# EAGLE design OSO-MISC-20-022 New Blinky Board for Ring (EAGLE 9.6.2)
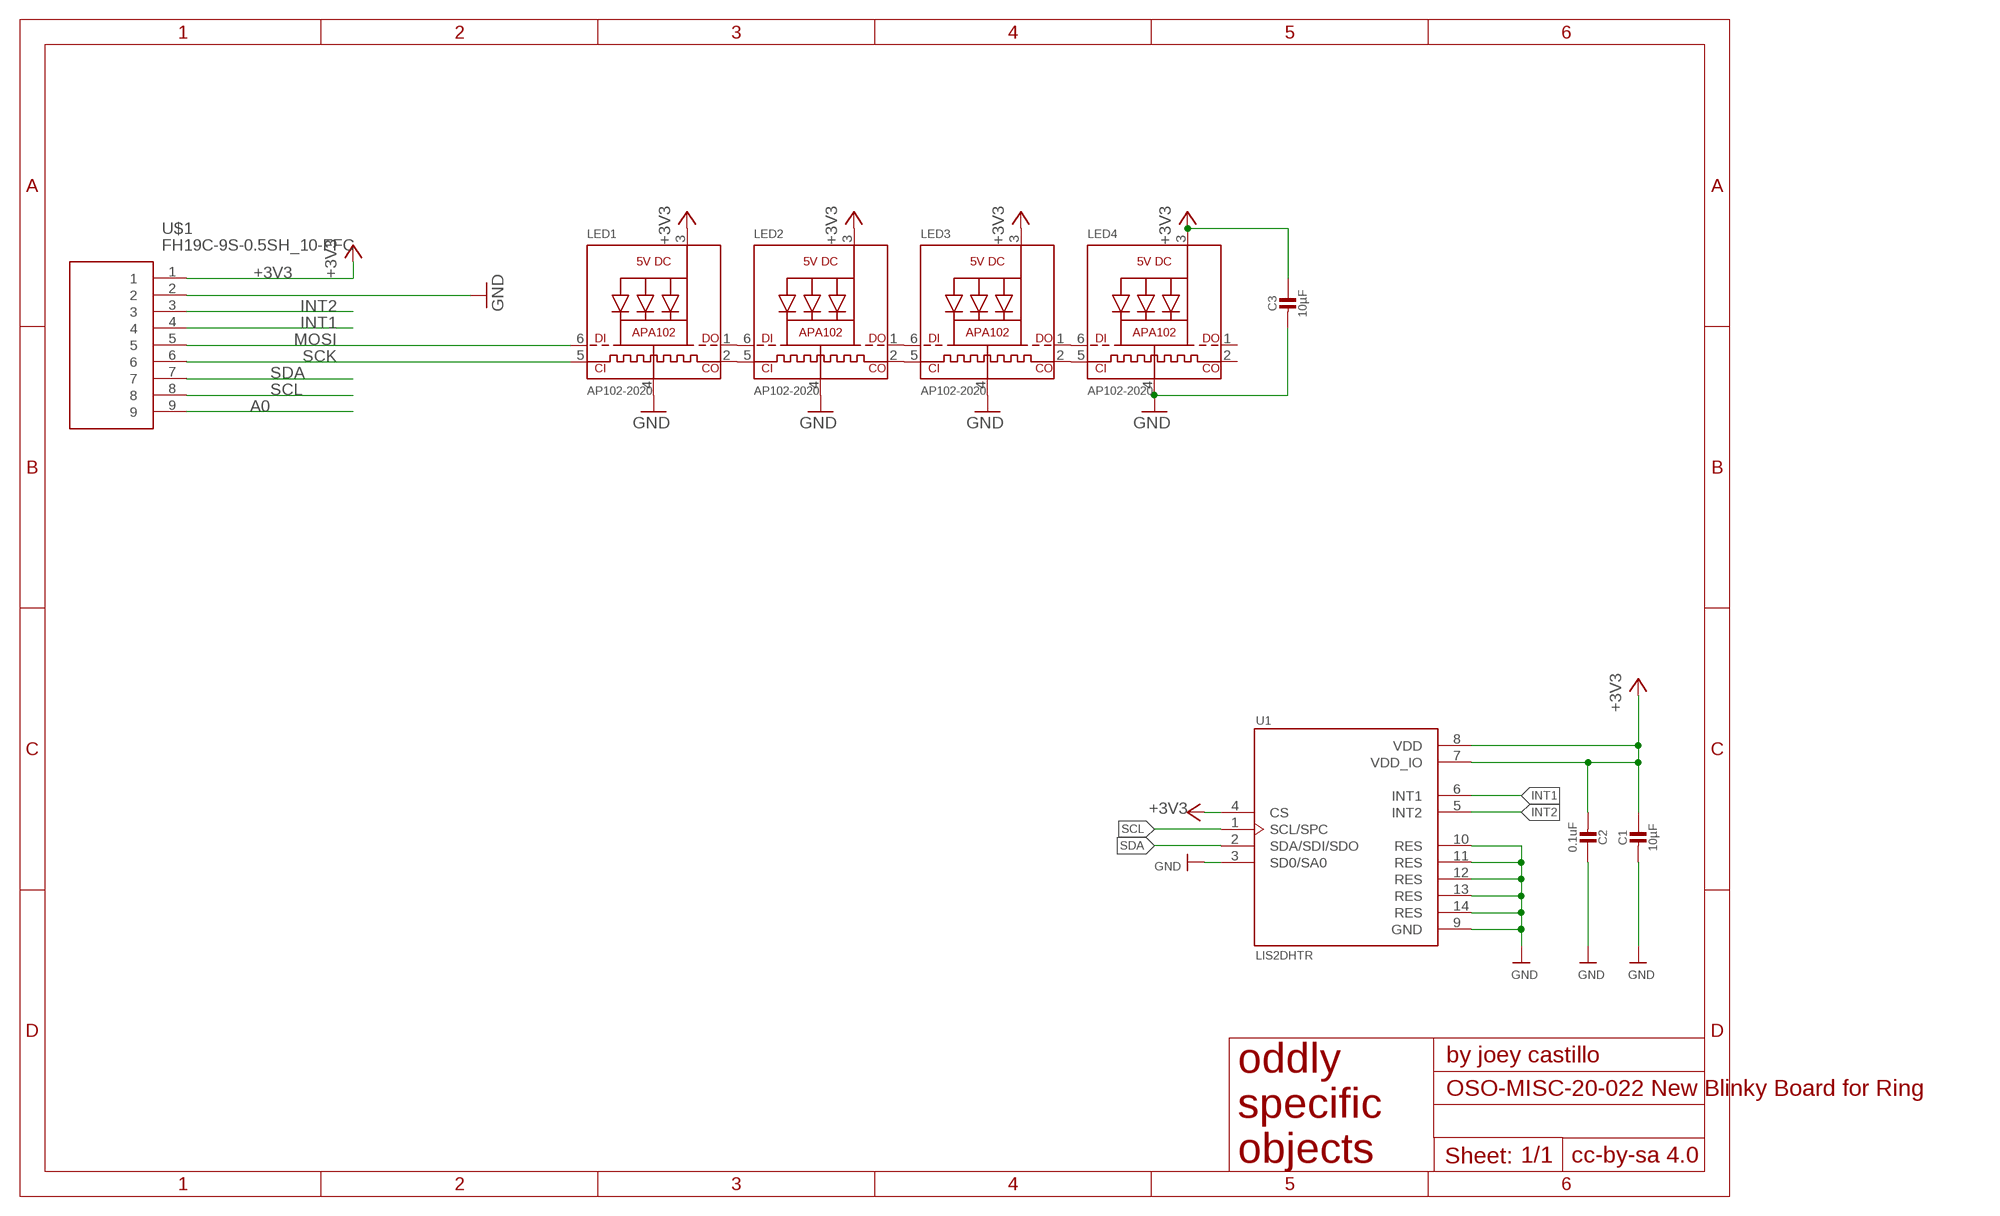
[diagram p0: schematic, sheet 1]

## Parts
C1  10µF  CAP_CERAMIC0805_10MGAP  [0805_10MGAP]
C2  0.1uF  CAP_CERAMIC0805-NOOUTLINE  [0805-NO]
C3  10µF  CAP_CERAMIC0805-NOOUTLINE  [0805-NO]
LED1  AP102-2020  APA1022020  [APA102_2020]
LED2  AP102-2020  APA1022020  [APA102_2020]
LED3  AP102-2020  APA1022020  [APA102_2020]
LED4  AP102-2020  APA1022020  [APA102_2020]
U1  LIS2DHTR  [PQFN35P200X200X100-14N]
U$1  FH19C-9S-0.5SH_10-FFC  [FH19C9S05SH10-FFC]

## Nets
+3V3: C1.1 C2.2 C3.1 LED1.3(VDD) LED2.3(VDD) LED3.3(VDD) LED4.3(VDD) U1.4(CS) U1.7(VDD_IO) U1.8(VDD) U$1.1
A0: U$1.9
GND: C1.2 C2.1 C3.2 LED1.4(GND) LED2.4(GND) LED3.4(GND) LED4.4(GND) U1.3(SD0/SA0) U1.9(GND) U1.10(RES) U1.11(RES) U1.12(RES) U1.13(RES) U1.14(RES) U$1.2
INT1: U1.6(INT1) U$1.4
INT2: U1.5(INT2) U$1.3
MOSI: LED1.6(DI) U$1.5
N$1: LED1.1(DO) LED2.6(DI)
N$2: LED1.2(CKO) LED2.5(CKI)
N$3: LED2.1(DO) LED3.6(DI)
N$4: LED2.2(CKO) LED3.5(CKI)
N$5: LED3.1(DO) LED4.6(DI)
N$6: LED3.2(CKO) LED4.5(CKI)
SCK: LED1.5(CKI) U$1.6
SCL: U1.1(SCL/SPC) U$1.8
SDA: U1.2(SDA/SDI/SDO) U$1.7
Unconnected: LED4.1(DO) LED4.2(CKO)

## Library data of the parts
C1-C3 = microbuilder:CAP_CERAMIC: Ceramic Capacitors For new designs, use the packages preceded by an '_' character since they are more reliable: The following footprints should be used on most boards: _0402 - Standard footprint for regular board layouts _0603 - Standard footprint for regular board layouts _0805 - Standard footprint for regular board layouts _1206 - Standard footprint for regular board layouts For extremely tight-pitch boards where space is at a premium, the following 'micro-pitch' footprints can be used (smaller pads, no silkscreen outline, etc.): _0402MP - Micro-pitch footprint for very dense/compact boards _0603MP - Micro-pitch footprint for very dense/compact boards _0805MP - Micro-pitch footprint for very dense/compact boards _1206MP - Micro-pitch footprint for very dense/compact boards
LED1-LED4 = microbuilder:APA102: APA102/DotStar Pixels VCC: 5V DC Refresh Rate: 400Hz
U1 = LIS2DHTR:LIS2DHTR: MEMS digital output motion sensor: ultra low-power high performance 3-axes femto accelerometer; DESCRIPTION: Accelerometer X, Y, Z Axis ±2g, 4g, 8g, 16g 0.5Hz ~ 672Hz 14-LGA _2x2_; DIGI-KEY_PART_NUMBER: 497-13795-1-ND; DIGI-KEY_PURCHASE_URL: https://www.digikey.com/product-detail/en/stmicroelectronics/LIS2DHTR/497-13795-1-ND/4209308?utm_source=snapeda&utm_medium=aggregator&utm_campaign=symbol; MF: STMicroelectronics; MP: LIS2DHTR; PACKAGE: LGA-14 STMicroelectronics
U$1 = FH19C-9S-0.5SH:FH19C-9S-0.5SH_10-FFC

## Net classes
1 power: width 0.305 mm

## Board
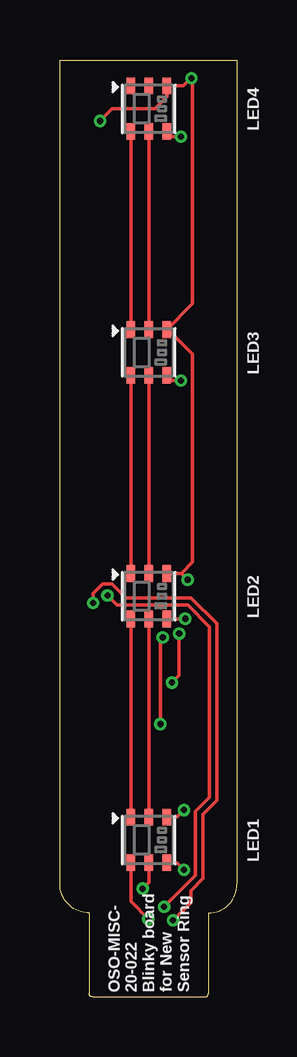
[diagram p1: board, top side]
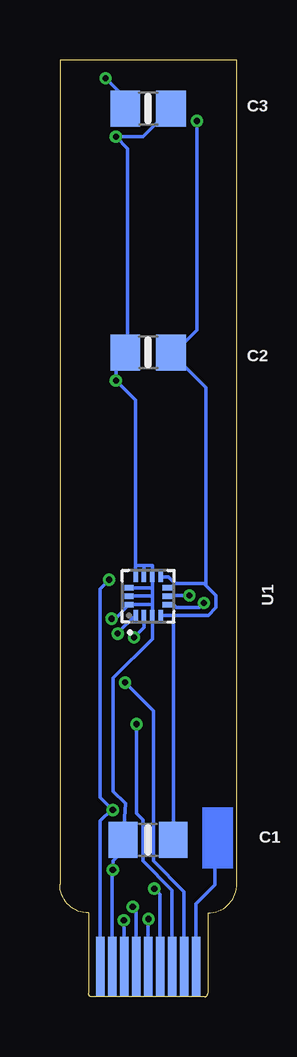
[diagram p2: board, bottom side, seen from below]

Size 7.39 x 39.06 mm. Coordinates in mm from the lower left corner, seen from the top.
Outline: 6.2,3.5 arc90 7.39,4.69 7.39,39.06 0,39.06 0,4.72 arc90 1.22,3.5
Copper layers (1*16): Top 0.035559375mm / dielectric 1.6mm / Bottom 0.035559375mm
Design rules "oshpark-2layer *": minimum track width 6mil, minimum drill 10mil, track to track 6mil, track to pad 6mil, pad to pad 6mil, via to via 6mil, smd to smd 6mil, copper to edge 15mil, drill to drill 6mil, minimum pad ring 5mil, minimum via ring 5mil, stop-mask expansion 2.5mil, vias tented up to drill 12mil, thermal gap 10mil

### Footprints (pad centres in the part's own frame; a part is rotated, then mirrored left to right if it is on the bottom)
0805_10MGAP = smd 1.2 x 1.5: 1 -1.05,0; 2 1.05,0
0805-NO = smd 1.24 x 1.5: 1 -0.95,0; 2 0.95,0
APA102_2020 = smd 0.7 x 0.35: 1 -0.95,-0.75; 2 -0.95,0; 3 -0.95,0.75; 4 0.95,0.75; 5 0.95,0; 6 0.95,-0.75
PQFN35P200X200X100-14N = smd 0.39 x 0.2: 1 -0.795,0.525; 2 -0.795,0.175; 3 -0.795,-0.175; 4 -0.795,-0.525; 8 0.795,-0.525; 9 0.795,-0.175; 10 0.795,0.175; 11 0.795,0.525 | smd 0.2 x 0.39: 5 -0.35,-0.795; 6 0,-0.795; 7 0.35,-0.795; 12 0.35,0.795; 13 0,0.795; 14 -0.35,0.795
FH19C9S05SH10-FFC = smd 0.347 x 2.5 bottom: 1 2,-2.25; 2 1.5,-2.25; 3 1,-2.25; 4 0.5,-2.25; 5 0,-2.25; 6 -0.5,-2.25; 7 -1,-2.25; 8 -1.5,-2.25; 9 -2,-2.25

### Placement (x,y rotation side)
C1  3.71,6.55 180 bottom
C2  3.71,26.87 0 bottom
C3  3.71,37.03 0 bottom
LED1  3.71,6.55 270 top
LED2  3.71,16.71 270 top
LED3  3.71,26.87 270 top
LED4  3.71,37.03 270 top
U1  3.71,16.71 90 bottom
U$1  3.71,3.5 0 top

### Tracks (layer width: path | path; a pad name or v marks a point on that pad's centre or on a via)
+3V3  (via drill 0.25)
  Top 0.152: v1.68,36.52 2.18,37.03 3.96,37.03 4.46,37.52 LED4.3 5.17,37.98 v5.49,38.3 5.54,38.25 5.54,28.9 LED3.3 4.51,27.82 5.54,26.79 5.54,18.12 5.07,17.66 | LED1.3 4.89,7.5 v5.18,7.79 | v5.33,17.39 5.07,17.66 | 5.07,17.66 LED2.3
  Bottom 0.152: 2.6,17.24 1.38,17.24 1.3,17.15 | 2.6,17.24 2.87,17.5 U1.8 | U1.4 2.66,15.91 | v1.68,36.52 1.68,27.8 2.6,26.87 C2.2 1.3,25.41 1.3,17.15 | v5.18,7.79 5.22,7.83 | 5.22,7.83 5.72,8.33 5.72,17.01 v5.33,17.39 | C3.1 4.66,37.47 v5.49,38.3 | U1.7 2.78,17.06 2.6,17.24 | C1.1 2.66,15.91 | 1.3,17.15 0.88,16.74 0.88,16.23 1.2,15.91 2.66,15.91 | U$1.1 5.71,7.34 5.22,7.83
A0
  Bottom 0.152: U$1.9 1.71,3.87 0.91,4.67 0.91,5.79
GND  (via drill 0.25)
  Top 0.152: LED1.4 4.89,5.6 v5.18,5.3 | LED2.4 v5.23,15.77 | v5.05,25.7 4.68,25.7 LED3.4 | v5.05,35.86 4.68,35.86 LED4.4
  Bottom 0.152: 3.88,17.98 4.23,17.98 | U1.10 3.88,17.98 | U1.11 4.23,17.98 | 3.53,16.36 U1.3 3.53,14.93 5.17,13.3 5.17,8.58 4.66,8.07 C1.2 4.66,6.19 5.18,5.67 v5.18,5.3 5.16,5.28 5.21,5.23 U$1.2 | 3.53,17.06 U1.9 3.53,17.98 3.88,17.98 | U1.13 3.53,16.71 | 3.53,16.36 U1.14 5.09,15.77 v5.23,15.77 | U1.12 3.53,17.06 | 3.53,16.36 3.53,16.71 | 3.53,17.06 3.53,16.71 | C3.2 3.93,35.86 v5.05,35.86 4.56,35.36 4.56,26.97 C2.1 5.05,26.47 v5.05,25.7 4.23,24.88 4.23,17.98
INT1  (via drill 0.25)
  Top 0.152: v1.98,16.73 2.38,16.34 5.35,16.34 6.25,15.44 6.25,8.33 5.66,7.74 5.66,5.07 v4.35,3.75
  Bottom 0.152: U1.6 2.89,16.73 v1.98,16.73 | U$1.4 4.21,3.61 v4.35,3.75
INT2  (via drill 0.25)
  Top 0.152: v1.38,16.42 1.38,16.81 1.78,17.22 2.18,17.22 2.76,16.64 5.47,16.64 6.55,15.56 6.55,8.2 5.97,7.62 5.97,4.94 5.46,4.43 5.46,3.93 v4.73,3.19
  Bottom 0.152: v1.38,16.42 1.57,16.23 2.53,16.23 2.66,16.36 U1.5 | U$1.3 4.71,3.18 v4.73,3.19
MOSI  (via drill 0.25)
  Top 0.152: v3.69,3.25 2.96,3.98 LED1.6
  Bottom 0.152: U$1.5 3.71,3.23 v3.69,3.25
N$1
  Top 0.152: LED1.1 LED2.6
N$2
  Top 0.152: LED1.2 LED2.5
N$3
  Top 0.152: LED2.1 LED3.6
N$4
  Top 0.152: LED3.5 LED2.2
N$5
  Top 0.152: LED4.6 LED3.1
N$6
  Top 0.152: LED3.2 LED4.5
SCK  (via drill 0.25)
  Top 0.152: v3.45,4.52 3.71,4.77 LED1.5
  Bottom 0.152: U$1.6 3.21,4.27 v3.45,4.52
SCL  (via drill 0.25)
  Top 0.152: v4.68,13.1 4.98,13.41 v4.98,15.15
  Bottom 0.152: U1.1 4.98,15.17 v4.98,15.15 | U$1.8 2.21,4.39 3.49,5.67 3.49,11.91 v4.68,13.1
SDA  (via drill 0.25)
  Top 0.152: v4.29,14.98 4.19,14.88 v4.19,11.37
  Bottom 0.152: v4.29,14.98 4.29,15 3.88,15.41 U1.2 | U$1.7 2.71,4.46 3.93,5.68 3.93,7.39 4.19,7.65 v4.19,11.37
(copper drawn outside any net)
  shapes: Bottom area x1

### Text on the board
tPlace: OSO-MISC- / 20-022 / Blinky board / for New / Sensor Ring